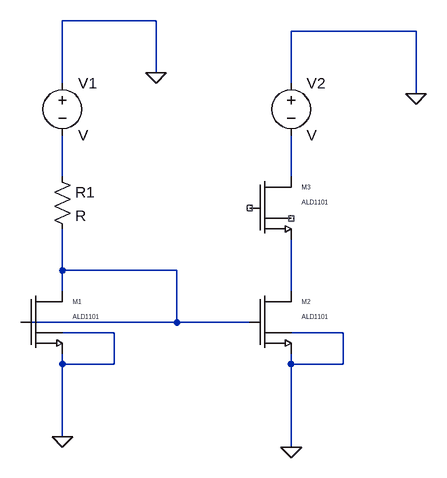
[diagram p0: schematic Draft1.asc]
Draft1.asc, the LTspice schematic file:
Version 4
SHEET 1 880 680
WIRE 208 -176 64 -176
WIRE 608 -160 416 -160
WIRE 208 -96 208 -176
WIRE 64 -80 64 -176
WIRE 416 -80 416 -160
WIRE 608 -64 608 -160
WIRE 64 64 64 0
WIRE 416 64 416 0
WIRE 64 208 64 144
WIRE 240 208 64 208
WIRE 64 240 64 208
WIRE 416 240 416 160
WIRE 240 288 240 208
WIRE 240 288 0 288
WIRE 352 288 240 288
WIRE 144 304 64 304
WIRE 496 304 416 304
WIRE 64 352 64 336
WIRE 144 352 144 304
WIRE 144 352 64 352
WIRE 416 352 416 336
WIRE 496 352 496 304
WIRE 496 352 416 352
WIRE 64 464 64 352
WIRE 416 480 416 352
FLAG 416 480 0
FLAG 208 -96 0
FLAG 64 464 0
FLAG 608 -64 0
SYMBOL res 48 48 R0
SYMATTR InstName R1
SYMBOL voltage 64 -96 R0
SYMATTR InstName V1
SYMBOL ALD1101 0 240 R0
SYMATTR InstName M1
SYMBOL ALD1101 352 240 R0
SYMATTR InstName M2
SYMBOL ALD1101 352 64 R0
SYMATTR InstName M3
SYMBOL voltage 416 -96 R0
SYMATTR InstName V2

The netlist it stands for:
* Draft1.asc
R1 N001 N003 R
V1 0 N001 V
M1 N003 N003 0 0 ALD1101 W=1.379e-3 L=1E-6
M2 N004 N003 0 0 ALD1101 W=1.379e-3 L=1E-6
M3 N002 NC_01 N004 NC_02 ALD1101 W=1.379e-3 L=1E-6
V2 0 N002 V
.model NMOS NMOS
.model PMOS PMOS
.lib standard.mos
.backanno
.end